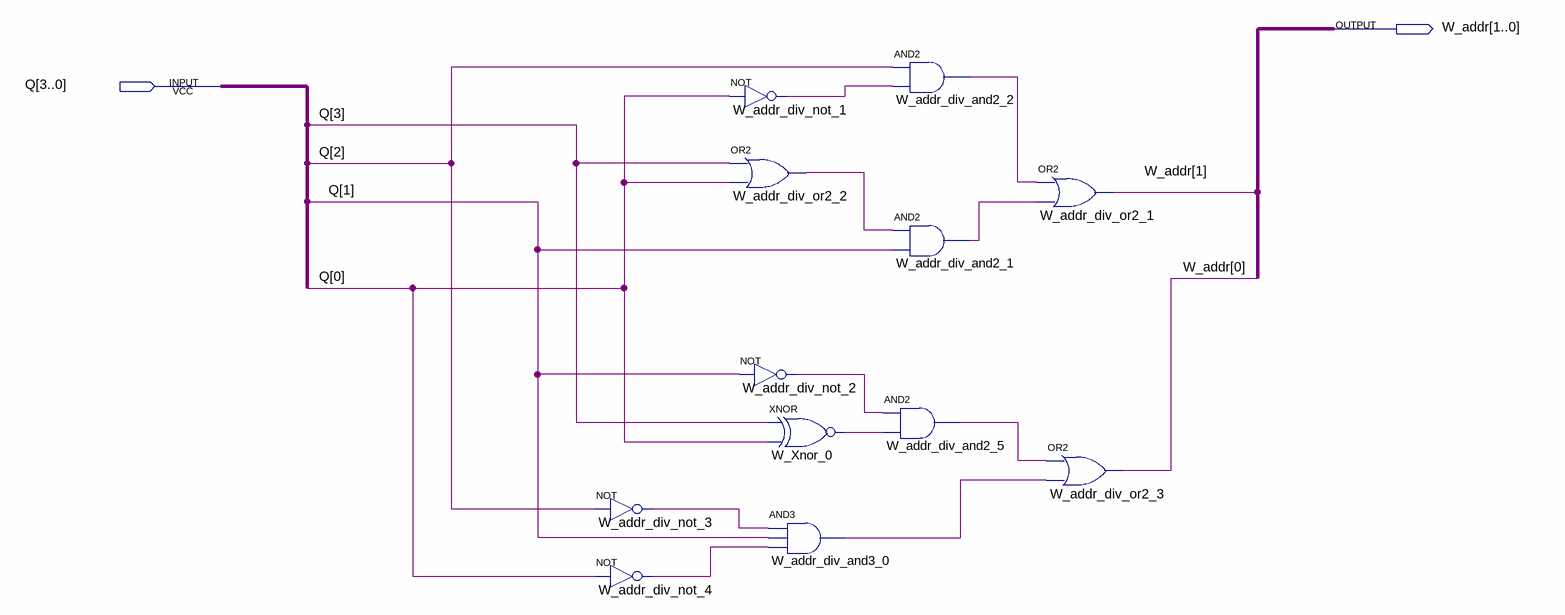
[diagram p0: schematic sheet]
// Quartus schematic W_Addr_Division.bdf as structural Verilog: 12 symbols, 2 pins
module W_Addr_Division (
  input  [3:0] Q,
  output [1:0] W_addr
);

  wire W_addr_div_and2_1_out, W_addr_div_and2_2_out, W_addr_div_and2_5_out, W_addr_div_and3_0_out,
       W_addr_div_not_1_out, W_addr_div_not_2_out, W_addr_div_not_3_out, W_addr_div_not_4_out,
       W_addr_div_or2_2_out, W_Xnor_0_out;

  not W_addr_div_not_3 (W_addr_div_not_3_out, Q[2]);
  not W_addr_div_not_4 (W_addr_div_not_4_out, Q[0]);
  not W_addr_div_not_1 (W_addr_div_not_1_out, Q[0]);
  or W_addr_div_or2_2 (W_addr_div_or2_2_out, Q[3], Q[0]);
  not W_addr_div_not_2 (W_addr_div_not_2_out, Q[1]);
  xnor W_Xnor_0 (W_Xnor_0_out, Q[3], Q[0]);
  and W_addr_div_and3_0 (W_addr_div_and3_0_out, W_addr_div_not_3_out, Q[1], W_addr_div_not_4_out);
  and W_addr_div_and2_2 (W_addr_div_and2_2_out, Q[2], W_addr_div_not_1_out);
  and W_addr_div_and2_1 (W_addr_div_and2_1_out, W_addr_div_or2_2_out, Q[1]);
  and W_addr_div_and2_5 (W_addr_div_and2_5_out, W_addr_div_not_2_out, W_Xnor_0_out);
  or W_addr_div_or2_1 (W_addr[1], W_addr_div_and2_2_out, W_addr_div_and2_1_out);
  or W_addr_div_or2_3 (W_addr[0], W_addr_div_and2_5_out, W_addr_div_and3_0_out);
endmodule
